# EasyEDA Pro project ProPrj_neopixel-seven-segment-display.epro

# Schematic neopixel-seven-segment-display

## Sheets
1 LEDs: Board Name: neopixel-seven-segment-display; Create Date: 2024-04-22; Page Name: LEDs; Project Name: neopixel-seven-segment-display; Schematic Name: neopixel-seven-segment-display; Update Date: 2025-08-29; Company: JES; Drawn: Justin F.; Page Size: A2; Reviewed: Justin F.; Version: V1.0
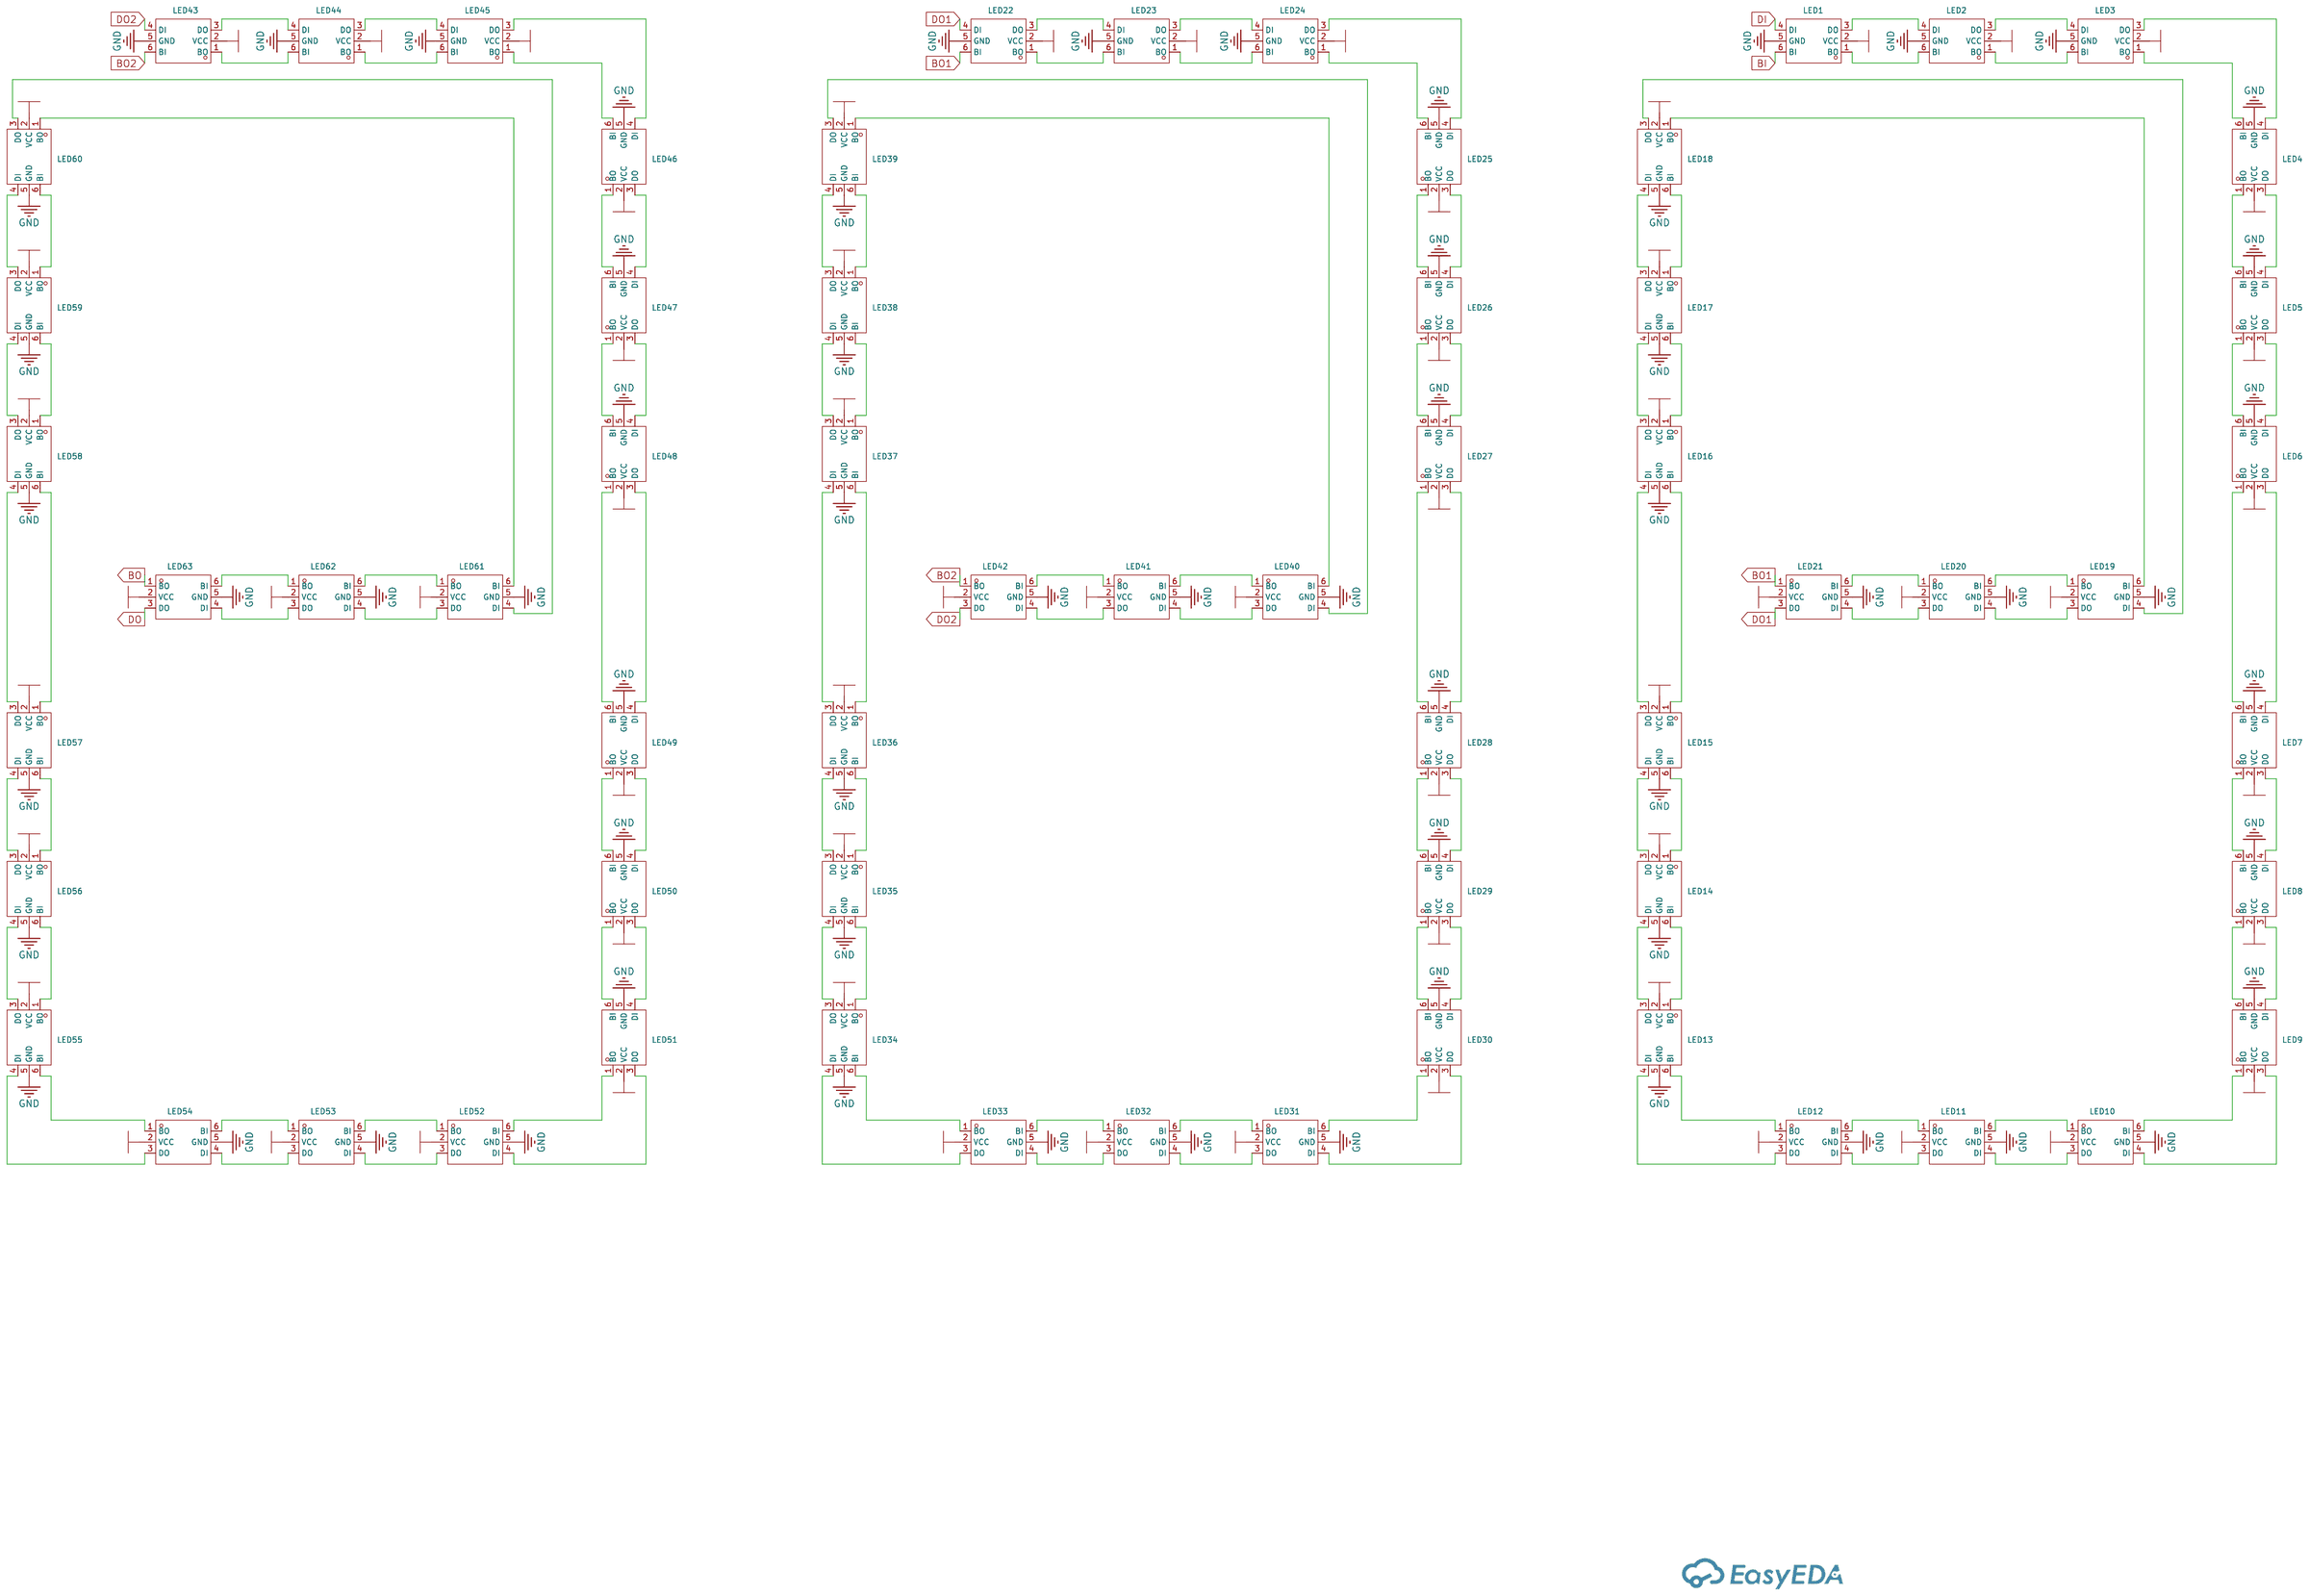
[diagram p0: LEDs]
2 Components: Page Name: Components; Update Date: 2026-04-27; Page Size: A4; Version: V2.0
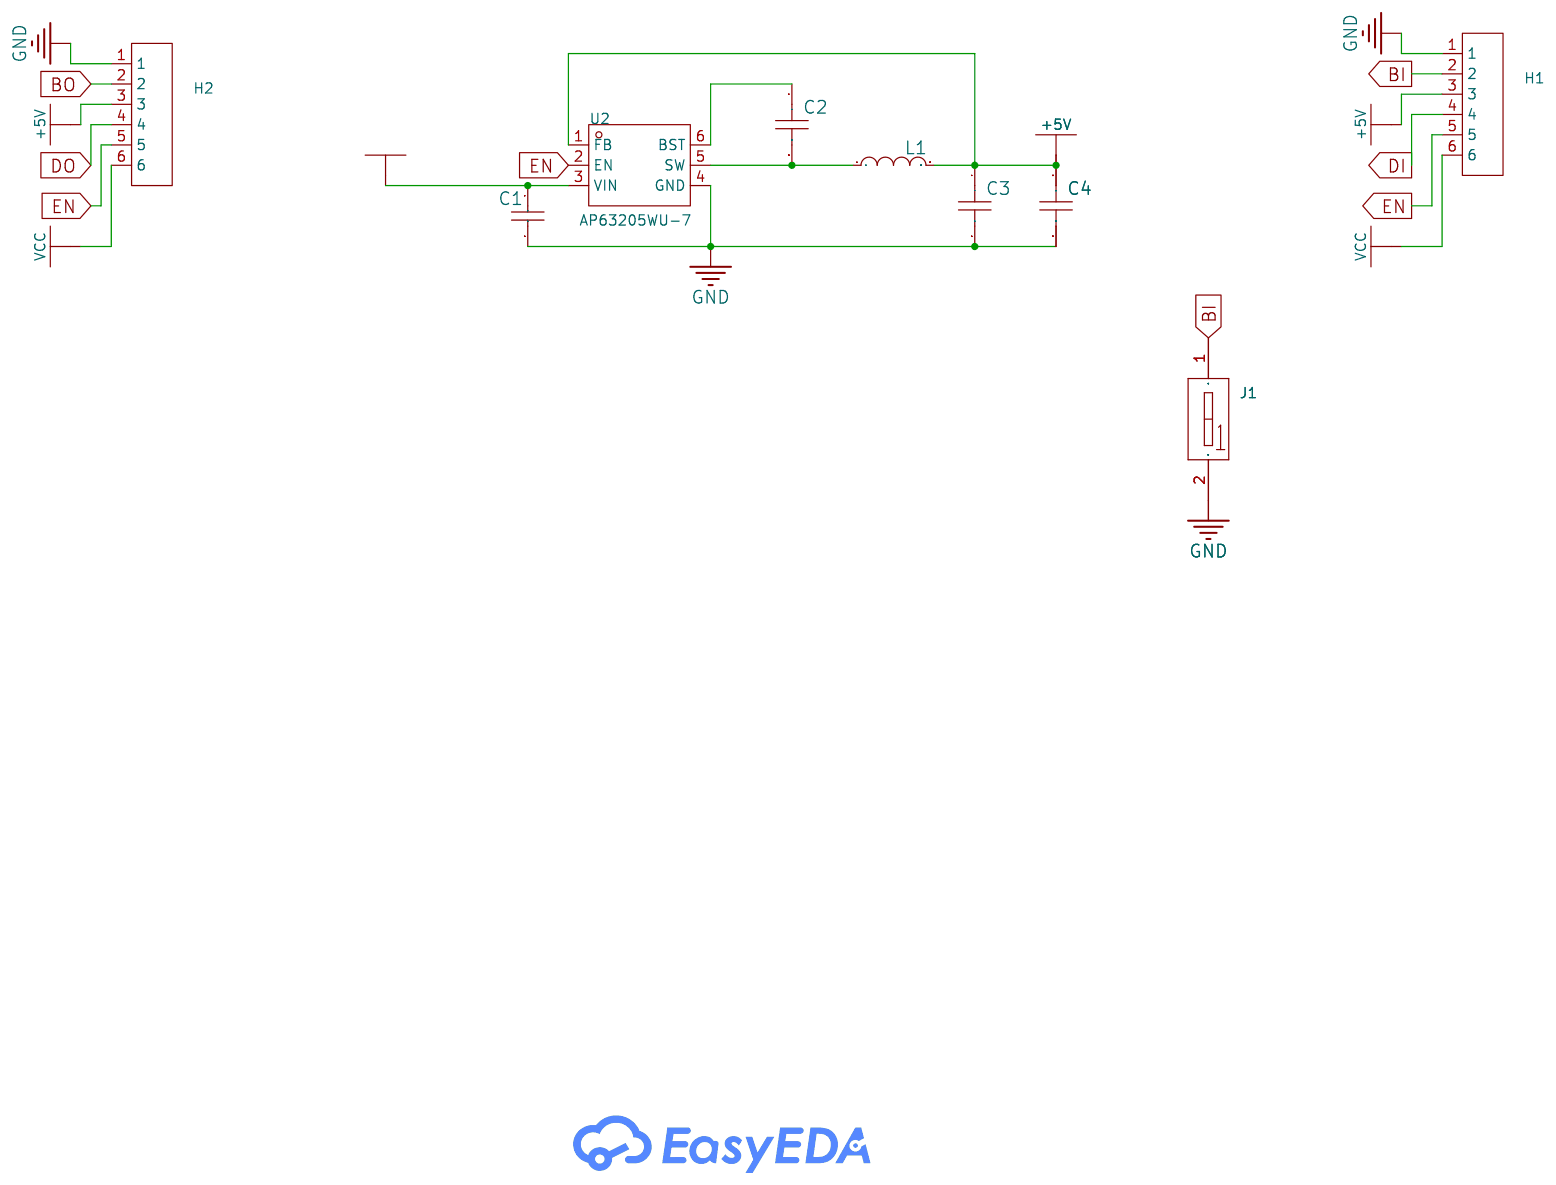
[diagram p1: Components]

## Parts
sheet Components
C1  10uF  [C1210]
C2  100nF  [C1206]
C3  22uF  [C1210]
C4  22uF  [C1210]
H1  DB2EVC-2.54-6P-GN  [CONN-TH_6P-P2.54_DIBO_DB2EVC-2.54-6P-GN]
H2  DB2EVC-2.54-6P-GN  [CONN-TH_6P-P2.54_DIBO_DB2EVC-2.54-6P-GN]
J1  DSWB01LHGET  [SW-TH_DSWB01LHGET]
L1  4.7uH  [IND-SMD_L3.2-W2.5_CMI3225XX]
U2  AP63205WU-7  [TSOT-23-6_L2.9-W1.6-P0.95-LS2.8-BL]
sheet LEDs
LED1  WS2813B-V5  [LED-SMD_6P-L5.0-W5.0-TL]
LED2  WS2813B-V5  [LED-SMD_6P-L5.0-W5.0-TL]
LED3  WS2813B-V5  [LED-SMD_6P-L5.0-W5.0-TL]
LED4  WS2813B-V5  [LED-SMD_6P-L5.0-W5.0-TL]
LED5  WS2813B-V5  [LED-SMD_6P-L5.0-W5.0-TL]
LED6  WS2813B-V5  [LED-SMD_6P-L5.0-W5.0-TL]
LED7  WS2813B-V5  [LED-SMD_6P-L5.0-W5.0-TL]
LED8  WS2813B-V5  [LED-SMD_6P-L5.0-W5.0-TL]
LED9  WS2813B-V5  [LED-SMD_6P-L5.0-W5.0-TL]
LED10  WS2813B-V5  [LED-SMD_6P-L5.0-W5.0-TL]
LED11  WS2813B-V5  [LED-SMD_6P-L5.0-W5.0-TL]
LED12  WS2813B-V5  [LED-SMD_6P-L5.0-W5.0-TL]
LED13  WS2813B-V5  [LED-SMD_6P-L5.0-W5.0-TL]
LED14  WS2813B-V5  [LED-SMD_6P-L5.0-W5.0-TL]
LED15  WS2813B-V5  [LED-SMD_6P-L5.0-W5.0-TL]
LED16  WS2813B-V5  [LED-SMD_6P-L5.0-W5.0-TL]
LED17  WS2813B-V5  [LED-SMD_6P-L5.0-W5.0-TL]
LED18  WS2813B-V5  [LED-SMD_6P-L5.0-W5.0-TL]
LED19  WS2813B-V5  [LED-SMD_6P-L5.0-W5.0-TL]
LED20  WS2813B-V5  [LED-SMD_6P-L5.0-W5.0-TL]
LED21  WS2813B-V5  [LED-SMD_6P-L5.0-W5.0-TL]
LED22  WS2813B-V5  [LED-SMD_6P-L5.0-W5.0-TL]
LED23  WS2813B-V5  [LED-SMD_6P-L5.0-W5.0-TL]
LED24  WS2813B-V5  [LED-SMD_6P-L5.0-W5.0-TL]
LED25  WS2813B-V5  [LED-SMD_6P-L5.0-W5.0-TL]
LED26  WS2813B-V5  [LED-SMD_6P-L5.0-W5.0-TL]
LED27  WS2813B-V5  [LED-SMD_6P-L5.0-W5.0-TL]
LED28  WS2813B-V5  [LED-SMD_6P-L5.0-W5.0-TL]
LED29  WS2813B-V5  [LED-SMD_6P-L5.0-W5.0-TL]
LED30  WS2813B-V5  [LED-SMD_6P-L5.0-W5.0-TL]
LED31  WS2813B-V5  [LED-SMD_6P-L5.0-W5.0-TL]
LED32  WS2813B-V5  [LED-SMD_6P-L5.0-W5.0-TL]
LED33  WS2813B-V5  [LED-SMD_6P-L5.0-W5.0-TL]
LED34  WS2813B-V5  [LED-SMD_6P-L5.0-W5.0-TL]
LED35  WS2813B-V5  [LED-SMD_6P-L5.0-W5.0-TL]
LED36  WS2813B-V5  [LED-SMD_6P-L5.0-W5.0-TL]
LED37  WS2813B-V5  [LED-SMD_6P-L5.0-W5.0-TL]
LED38  WS2813B-V5  [LED-SMD_6P-L5.0-W5.0-TL]
LED39  WS2813B-V5  [LED-SMD_6P-L5.0-W5.0-TL]
LED40  WS2813B-V5  [LED-SMD_6P-L5.0-W5.0-TL]
LED41  WS2813B-V5  [LED-SMD_6P-L5.0-W5.0-TL]
LED42  WS2813B-V5  [LED-SMD_6P-L5.0-W5.0-TL]
LED43  WS2813B-V5  [LED-SMD_6P-L5.0-W5.0-TL]
LED44  WS2813B-V5  [LED-SMD_6P-L5.0-W5.0-TL]
LED45  WS2813B-V5  [LED-SMD_6P-L5.0-W5.0-TL]
LED46  WS2813B-V5  [LED-SMD_6P-L5.0-W5.0-TL]
LED47  WS2813B-V5  [LED-SMD_6P-L5.0-W5.0-TL]
LED48  WS2813B-V5  [LED-SMD_6P-L5.0-W5.0-TL]
LED49  WS2813B-V5  [LED-SMD_6P-L5.0-W5.0-TL]
LED50  WS2813B-V5  [LED-SMD_6P-L5.0-W5.0-TL]
LED51  WS2813B-V5  [LED-SMD_6P-L5.0-W5.0-TL]
LED52  WS2813B-V5  [LED-SMD_6P-L5.0-W5.0-TL]
LED53  WS2813B-V5  [LED-SMD_6P-L5.0-W5.0-TL]
LED54  WS2813B-V5  [LED-SMD_6P-L5.0-W5.0-TL]
LED55  WS2813B-V5  [LED-SMD_6P-L5.0-W5.0-TL]
LED56  WS2813B-V5  [LED-SMD_6P-L5.0-W5.0-TL]
LED57  WS2813B-V5  [LED-SMD_6P-L5.0-W5.0-TL]
LED58  WS2813B-V5  [LED-SMD_6P-L5.0-W5.0-TL]
LED59  WS2813B-V5  [LED-SMD_6P-L5.0-W5.0-TL]
LED60  WS2813B-V5  [LED-SMD_6P-L5.0-W5.0-TL]
LED61  WS2813B-V5  [LED-SMD_6P-L5.0-W5.0-TL]
LED62  WS2813B-V5  [LED-SMD_6P-L5.0-W5.0-TL]
LED63  WS2813B-V5  [LED-SMD_6P-L5.0-W5.0-TL]

## Library data of the parts
C1 = CL32B106KAJNNNE: Capacitance: Tolerance:±10% Tolerance:±10% Voltage Rated: Temperature Coefficient:; LCSC Part Name: 10uF ±10% 25V; Supplier Part: C39232; Manufacturer: SAMSUNG(三星); Supplier Footprint: 1210; JLCPCB Part Class: Extended Part; Datasheet: https://atta.szlcsc.com/upload/public/pdf/source/20160218/1457707763339.pdf; Supplier: LCSC; Tolerance: ±10%; Check: false
C2 = 1206N104J500CT: Capacitance: Tolerance:±5% Tolerance:±5% Voltage Rated: Temperature Coefficient:; LCSC Part Name: 100nF ±5% 50V; Supplier Part: C170182; Manufacturer: Walsin(华新科); Supplier Footprint: 1206; JLCPCB Part Class: Extended Part; Datasheet: https://atta.szlcsc.com/upload/public/pdf/source/20190524/C388053_0CD3F469255EF43E616A57DAC128F58D.pdf; Supplier: LCSC; Tolerance: ±5%; Check: false
C3 C4 = CL32B226KAJNNNE: Capacitance: Tolerance:±10% Tolerance:±10% Voltage Rated: Temperature Coefficient:; LCSC Part Name: 22uF ±10% 25V; Supplier Part: C309062; Manufacturer: SAMSUNG(三星); Supplier Footprint: 1210; JLCPCB Part Class: Extended Part; Datasheet: https://atta.szlcsc.com/upload/public/pdf/source/20160218/1457707763339.pdf; Supplier: LCSC; Tolerance: ±10%; Check: false
H1 H2 = DB2EVC-2.54-6P-GN: Connector Type:Board Side/Socket - Closed Termination Style:- Number of Positions or Pins:1x6P Pitch:2.54mm Color:Green Mounting Type:Through Hole Number of Pins:6P Number of Rows:1 Number of PINs Per Row:6 Current Rating:5A Voltage Rating (Max):320V Wire; LCSC Part Name: 1x6P 2.54mm 排数:1 每排P数:6; Supplier Part: C2927497; Manufacturer: DORABO(地博电气); Supplier Footprint: 插件,P=2.54mm; JLCPCB Part Class: Extended Part; Datasheet: https://item.szlcsc.com/datasheet/DB2EVC-2.54-6P-GN/3255033.html; Supplier: LCSC; Connector Type: Board Side/Socket - Closed; Number of Positions or Pins: 1x6P; Pitch: 2.54mm; Color: Green; Mounting Type: Through Hole; Number of Pins: 6P; Number of Rows: 1; Number of PINs Per Row: 6; Current Rating: 5A; Voltage Rating (Max): 320V; Operating Temperature: -40℃~+105℃
J1 = DSWB01LHGET: Type:Slide, Rocked Circuit:SPST Number of Positions:1 Lead Pitch:- Operating Life:- Color:Red; LCSC Part Name: 红色宽体1位顶拨插件; Supplier Part: C126888; Manufacturer: YE; Supplier Footprint: 插件,9.9x4mm; JLCPCB Part Class: Extended Part; Datasheet: https://item.szlcsc.com/datasheet/DSWB01LHGET/138168.html; Supplier: LCSC; Type: Slide, Rocked; Circuit: SPST; Number of Positions: 1; Color: Red
L1 = DFE322520FD-4R7M=P2: Inductance: Tolerance:±20% Tolerance:±20% Rated Current:2A Saturation Current (Isat):3.4A DC Resistance (DCR): Ratings:AEC-Q200; LCSC Part Name: 4.7uH ±20% 3.4A; Supplier Part: C2045343; Manufacturer: muRata(村田); Supplier Footprint: 1210; JLCPCB Part Class: Extended Part; Datasheet: https://atta.szlcsc.com/upload/public/pdf/source/20230811/E685BADDC9D496FFC5350CE0F3D93440.pdf; Supplier: LCSC; Tolerance: ±20%; Rated Current: 2A; Saturation Current (Isat): 3.4A; DC Resistance (DCR): 34.5mΩ; Ratings: AEC-Q200; Check: false
U2 = AP63205WU-7: Function:Buck Voltage - Supply:3.8V~32V Voltage - Supply:3.8V~32V Output Voltage:5V Output Voltage:5V Output Current:2A Frequency - Switching:1.1MHz Frequency - Switching:1.1MHz Operating Temperature:-40℃~+85℃@(TA) Operating Temperature:-40℃~+85℃@(TA) Syn; LCSC Part Name: 3.8V至32V输入、2A低静态电流同步降压转换器，增强EMI抑制; Supplier Part: C2071056; Manufacturer: DIODES(美台); Supplier Footprint: TSOT-23-6; JLCPCB Part Class: Extended Part; Datasheet: https://item.szlcsc.com/datasheet/AP63205WU-7/2162639.html; Supplier: LCSC; Function: Buck; Synchronous Rectification: Yes; Output Type: Fixed; Number of Outputs: 1; Topology: Buck; Input Voltage: 3.8V~32V; Output Voltage: 5V; Output Current (Max): 2A; Switching Frequency: 1.1MHz; Operating Temperature: -40℃~+85℃@(TA); Check: false; Voltage - Supply: 3.8V~32V; Output Current: 2A; Frequency - Switching: 1.1MHz; Synchronous Rectifier: Yes; Quiescent Current: 22uA; Switch tube (built-in/external): Built-In
LED1-LED63 = WS2813B-V5: Emitted Color:RGB Power Dissipation:- Forward Current:16mA Dominant Wavelength:623nm；471nm；520nm Dominant Wavelength:623nm；471nm；520nm Peak Wavelength:- Diode Configuration:- Lens Color:- Color Temperature:- Color Temperature:- Viewing Angle:- Mounting Sy; LCSC Part Name: RGB三色; Supplier Part: C965558; Manufacturer: worldsemi; Supplier Footprint: SMD5050; JLCPCB Part Class: Extended Part; Datasheet: https://atta.szlcsc.com/upload/public/pdf/source/20201203/C965558_3788C892C3E72C9CF7EE66566AC16D5A.pdf; Supplier: LCSC; Emitted Color: RGB; Forward Current: 16mA; Dominant Wavelength: 623nm；471nm；520nm; Check: false

## Nets
+5V: C3.1 C4.1 H1.3 H2.3 L1.2 LED1.2(VCC) LED2.2(VCC) LED3.2(VCC) LED4.2(VCC) LED5.2(VCC) LED6.2(VCC) LED7.2(VCC) LED8.2(VCC) LED9.2(VCC) LED10.2(VCC) LED11.2(VCC) LED12.2(VCC) LED13.2(VCC) LED14.2(VCC) LED15.2(VCC) LED16.2(VCC) LED17.2(VCC) LED18.2(VCC) LED19.2(VCC) LED20.2(VCC) LED21.2(VCC) LED22.2(VCC) LED23.2(VCC) LED24.2(VCC) LED25.2(VCC) LED26.2(VCC) LED27.2(VCC) LED28.2(VCC) LED29.2(VCC) LED30.2(VCC) LED31.2(VCC) LED32.2(VCC) LED33.2(VCC) LED34.2(VCC) LED35.2(VCC) LED36.2(VCC) LED37.2(VCC) LED38.2(VCC) LED39.2(VCC) LED40.2(VCC) LED41.2(VCC) LED42.2(VCC) LED43.2(VCC) LED44.2(VCC) LED45.2(VCC) LED46.2(VCC) LED47.2(VCC) LED48.2(VCC) LED49.2(VCC) LED50.2(VCC) LED51.2(VCC) LED52.2(VCC) LED53.2(VCC) LED54.2(VCC) LED55.2(VCC) LED56.2(VCC) LED57.2(VCC) LED58.2(VCC) LED59.2(VCC) LED60.2(VCC) LED61.2(VCC) LED62.2(VCC) LED63.2(VCC) U2.1(FB)
GND: C1.2 C3.2 C4.2 H1.1 H2.1 J1.2 LED1.5(GND) LED2.5(GND) LED3.5(GND) LED4.5(GND) LED5.5(GND) LED6.5(GND) LED7.5(GND) LED8.5(GND) LED9.5(GND) LED10.5(GND) LED11.5(GND) LED12.5(GND) LED13.5(GND) LED14.5(GND) LED15.5(GND) LED16.5(GND) LED17.5(GND) LED18.5(GND) LED19.5(GND) LED20.5(GND) LED21.5(GND) LED22.5(GND) LED23.5(GND) LED24.5(GND) LED25.5(GND) LED26.5(GND) LED27.5(GND) LED28.5(GND) LED29.5(GND) LED30.5(GND) LED31.5(GND) LED32.5(GND) LED33.5(GND) LED34.5(GND) LED35.5(GND) LED36.5(GND) LED37.5(GND) LED38.5(GND) LED39.5(GND) LED40.5(GND) LED41.5(GND) LED42.5(GND) LED43.5(GND) LED44.5(GND) LED45.5(GND) LED46.5(GND) LED47.5(GND) LED48.5(GND) LED49.5(GND) LED50.5(GND) LED51.5(GND) LED52.5(GND) LED53.5(GND) LED54.5(GND) LED55.5(GND) LED56.5(GND) LED57.5(GND) LED58.5(GND) LED59.5(GND) LED60.5(GND) LED61.5(GND) LED62.5(GND) LED63.5(GND) U2.4(GND)
VCC: C1.1 H1.6 H2.6 U2.3(VIN)
BI: H1.2 J1.1(A1) LED1.6(BI)
BO: H2.2 LED63.1(BO)
BO1: LED21.1(BO) LED22.6(BI)
BO2: LED42.1(BO) LED43.6(BI)
DI: H1.4 LED1.4(DI)
DO: H2.4 LED63.3(DO)
DO1: LED21.3(DO) LED22.4(DI)
DO2: LED42.3(DO) LED43.4(DI)
EN: H1.5 H2.5 U2.2(EN)
$2N332268: LED1.3(DO) LED2.4(DI)
$2N332275: LED2.3(DO) LED3.4(DI)
$2N332294: LED1.1(BO) LED2.6(BI)
$2N332300: LED2.1(BO) LED3.6(BI)
$2N332306: LED3.1(BO) LED4.6(BI)
$2N332313: LED3.3(DO) LED4.4(DI)
$2N332321: LED4.1(BO) LED5.6(BI)
$2N332324: LED4.3(DO) LED5.4(DI)
$2N332327: LED5.1(BO) LED6.6(BI)
$2N332330: LED5.3(DO) LED6.4(DI)
$2N332493: LED7.1(BO) LED8.6(BI)
$2N332495: LED7.3(DO) LED8.4(DI)
$2N332497: LED8.1(BO) LED9.6(BI)
$2N332499: LED8.3(DO) LED9.4(DI)
$2N332503: LED9.1(BO) LED10.6(BI)
$2N332507: LED9.3(DO) LED10.4(DI)
$2N332511: LED10.3(DO) LED11.4(DI)
$2N332514: LED10.1(BO) LED11.6(BI)
$2N332517: LED11.1(BO) LED12.6(BI)
$2N332520: LED11.3(DO) LED12.4(DI)
$2N332523: LED12.3(DO) LED13.4(DI)
$2N332527: LED12.1(BO) LED13.6(BI)
$2N332531: LED13.3(DO) LED14.4(DI)
$2N332534: LED13.1(BO) LED14.6(BI)
$2N332537: LED14.3(DO) LED15.4(DI)
$2N332543: LED14.1(BO) LED15.6(BI)
$2N332549: LED15.3(DO) LED16.4(DI)
$2N332556: LED15.1(BO) LED16.6(BI)
$2N332563: LED16.3(DO) LED17.4(DI)
$2N332570: LED16.1(BO) LED17.6(BI)
$2N332577: LED17.3(DO) LED18.4(DI)
$2N332584: LED17.1(BO) LED18.6(BI)
$2N332696: LED6.1(BO) LED7.6(BI)
$2N332699: LED6.3(DO) LED7.4(DI)
$2N332702: LED18.1(BO) LED19.6(BI)
$2N332706: LED18.3(DO) LED19.4(DI)
$2N332712: LED19.1(BO) LED20.6(BI)
$2N332718: LED19.3(DO) LED20.4(DI)
$2N332724: LED20.1(BO) LED21.6(BI)
$2N332731: LED20.3(DO) LED21.4(DI)
$2N335047: LED22.3(DO) LED23.4(DI)
$2N335051: LED23.3(DO) LED24.4(DI)
$2N335055: LED22.1(BO) LED23.6(BI)
$2N335060: LED23.1(BO) LED24.6(BI)
$2N335064: LED24.1(BO) LED25.6(BI)
$2N335069: LED24.3(DO) LED25.4(DI)
$2N335074: LED25.1(BO) LED26.6(BI)
$2N335078: LED25.3(DO) LED26.4(DI)
$2N335082: LED26.1(BO) LED27.6(BI)
$2N335086: LED26.3(DO) LED27.4(DI)
$2N335090: LED28.1(BO) LED29.6(BI)
$2N335094: LED28.3(DO) LED29.4(DI)
$2N335098: LED29.1(BO) LED30.6(BI)
$2N335102: LED29.3(DO) LED30.4(DI)
$2N335106: LED30.1(BO) LED31.6(BI)
$2N335111: LED30.3(DO) LED31.4(DI)
$2N335116: LED31.3(DO) LED32.4(DI)
$2N335120: LED31.1(BO) LED32.6(BI)
$2N335124: LED32.1(BO) LED33.6(BI)
$2N335128: LED32.3(DO) LED33.4(DI)
$2N335132: LED33.3(DO) LED34.4(DI)
$2N335137: LED33.1(BO) LED34.6(BI)
$2N335142: LED34.3(DO) LED35.4(DI)
$2N335146: LED34.1(BO) LED35.6(BI)
$2N335150: LED35.3(DO) LED36.4(DI)
$2N335154: LED35.1(BO) LED36.6(BI)
$2N335158: LED36.3(DO) LED37.4(DI)
$2N335162: LED36.1(BO) LED37.6(BI)
$2N335166: LED37.3(DO) LED38.4(DI)
$2N335170: LED37.1(BO) LED38.6(BI)
$2N335174: LED38.3(DO) LED39.4(DI)
$2N335178: LED38.1(BO) LED39.6(BI)
$2N335182: LED27.1(BO) LED28.6(BI)
$2N335186: LED27.3(DO) LED28.4(DI)
$2N335190: LED39.1(BO) LED40.6(BI)
$2N335193: LED39.3(DO) LED40.4(DI)
$2N335200: LED40.1(BO) LED41.6(BI)
$2N335204: LED40.3(DO) LED41.4(DI)
$2N335208: LED41.1(BO) LED42.6(BI)
$2N335212: LED41.3(DO) LED42.4(DI)
$2N338899: LED43.3(DO) LED44.4(DI)
$2N338903: LED44.3(DO) LED45.4(DI)
$2N338907: LED43.1(BO) LED44.6(BI)
$2N338911: LED44.1(BO) LED45.6(BI)
$2N338915: LED45.1(BO) LED46.6(BI)
$2N338920: LED45.3(DO) LED46.4(DI)
$2N338925: LED46.1(BO) LED47.6(BI)
$2N338929: LED46.3(DO) LED47.4(DI)
$2N338933: LED47.1(BO) LED48.6(BI)
$2N338937: LED47.3(DO) LED48.4(DI)
$2N338941: LED49.1(BO) LED50.6(BI)
$2N338945: LED49.3(DO) LED50.4(DI)
$2N338949: LED50.1(BO) LED51.6(BI)
$2N338953: LED50.3(DO) LED51.4(DI)
$2N338957: LED51.1(BO) LED52.6(BI)
$2N338962: LED51.3(DO) LED52.4(DI)
$2N338967: LED52.3(DO) LED53.4(DI)
$2N338971: LED52.1(BO) LED53.6(BI)
$2N338975: LED53.1(BO) LED54.6(BI)
$2N338979: LED53.3(DO) LED54.4(DI)
$2N338983: LED54.3(DO) LED55.4(DI)
$2N338988: LED54.1(BO) LED55.6(BI)
$2N338993: LED55.3(DO) LED56.4(DI)
$2N338997: LED55.1(BO) LED56.6(BI)
$2N339001: LED56.3(DO) LED57.4(DI)
$2N339005: LED56.1(BO) LED57.6(BI)
$2N339009: LED57.3(DO) LED58.4(DI)
$2N339013: LED57.1(BO) LED58.6(BI)
$2N339017: LED58.3(DO) LED59.4(DI)
$2N339021: LED58.1(BO) LED59.6(BI)
$2N339025: LED59.3(DO) LED60.4(DI)
$2N339029: LED59.1(BO) LED60.6(BI)
$2N339033: LED48.1(BO) LED49.6(BI)
$2N339037: LED48.3(DO) LED49.4(DI)
$2N339041: LED60.1(BO) LED61.6(BI)
$2N339044: LED60.3(DO) LED61.4(DI)
$2N339051: LED61.1(BO) LED62.6(BI)
$2N339055: LED61.3(DO) LED62.4(DI)
$2N339059: LED62.1(BO) LED63.6(BI)
$2N339063: LED62.3(DO) LED63.4(DI)
$3N5692: C2.2 L1.1 U2.5(SW)
$3N12733: C2.1 U2.6(BST)

# Board neopixel-seven-segment-display
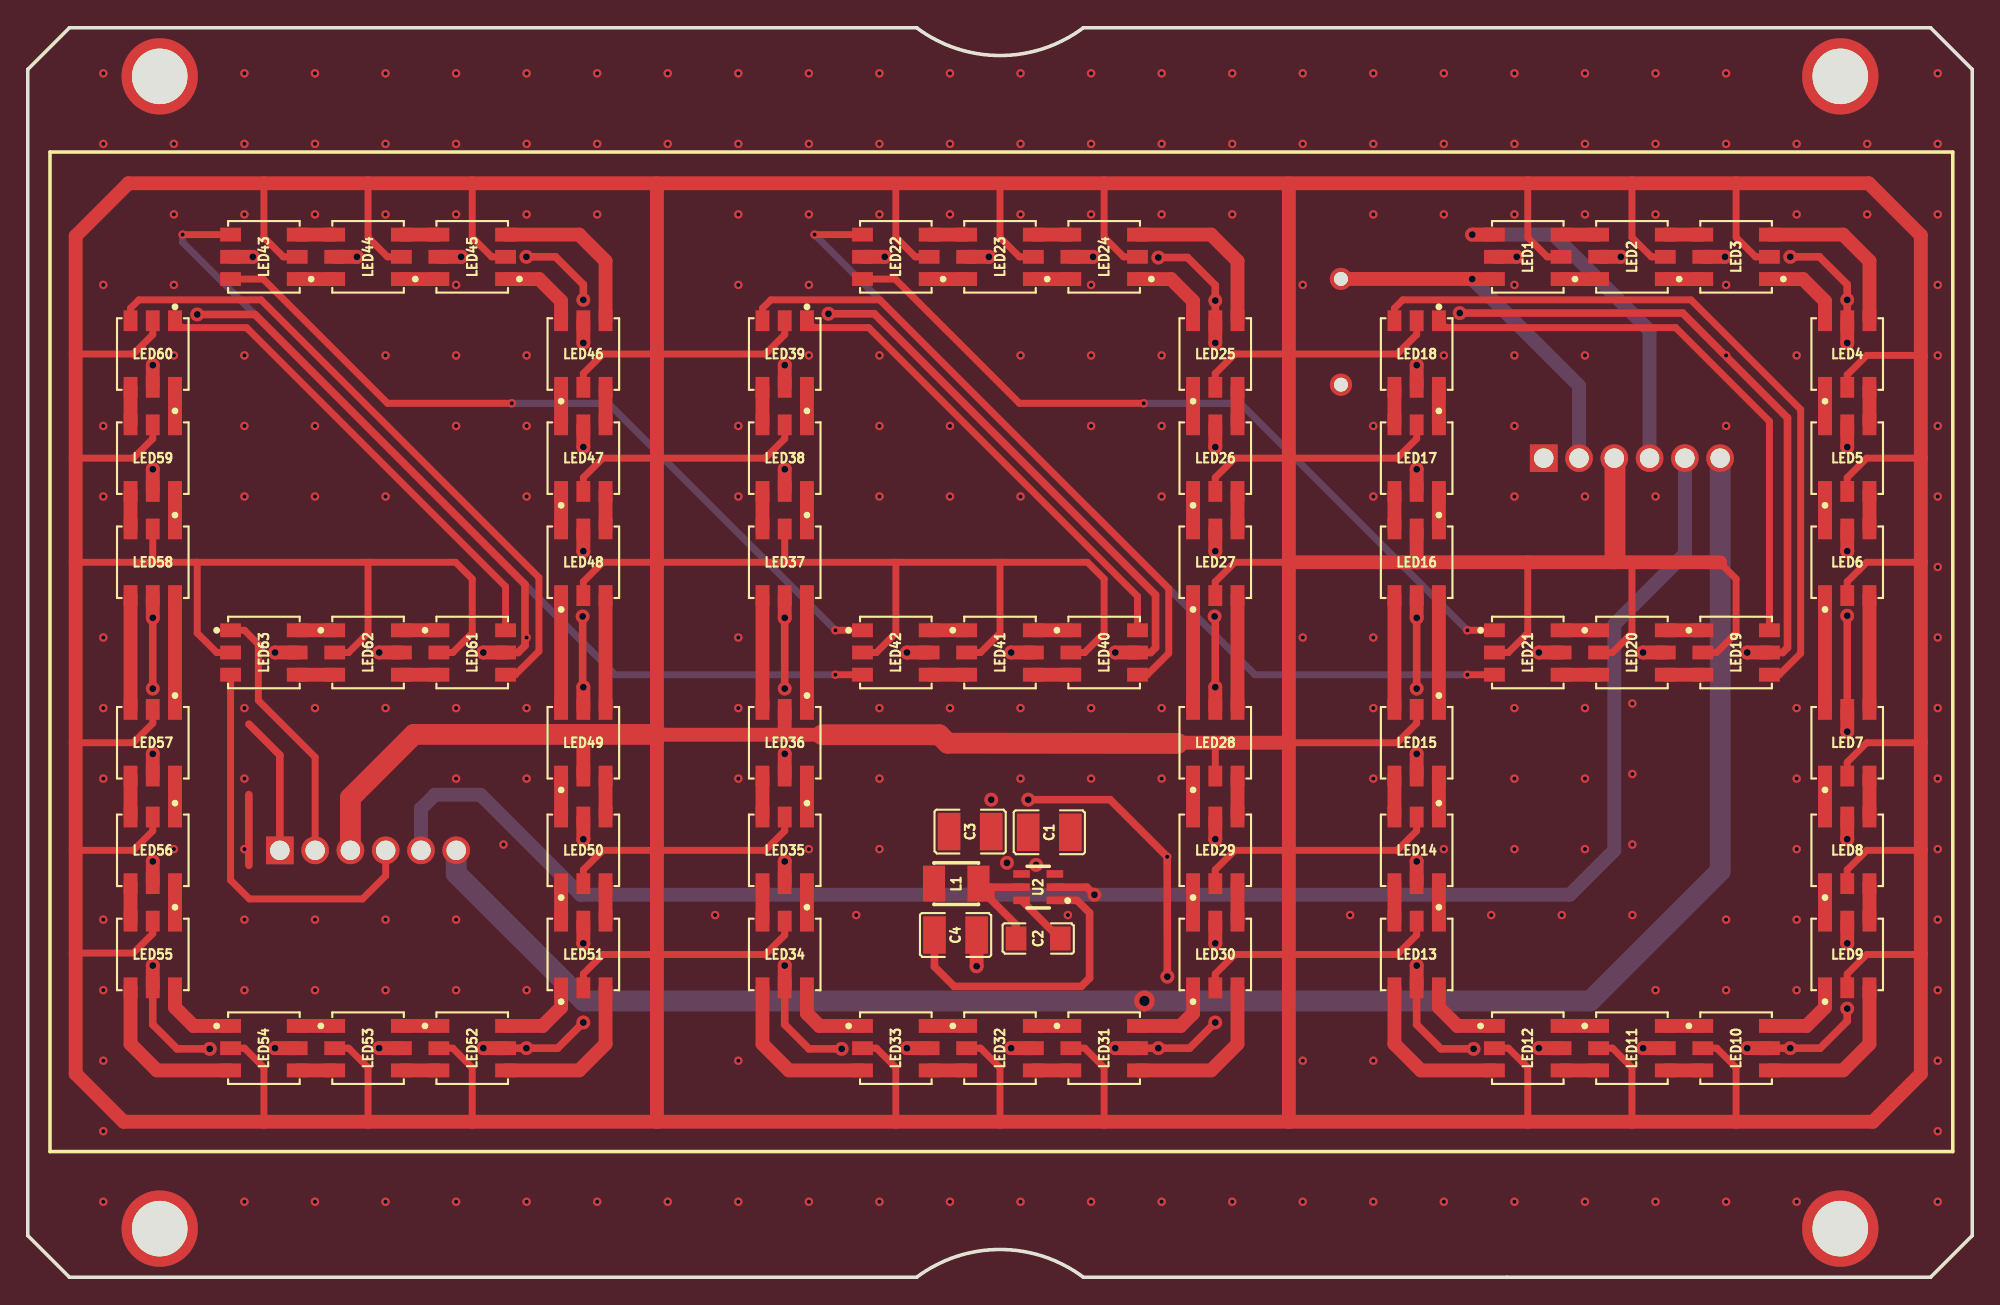
[diagram p2: board, top side]
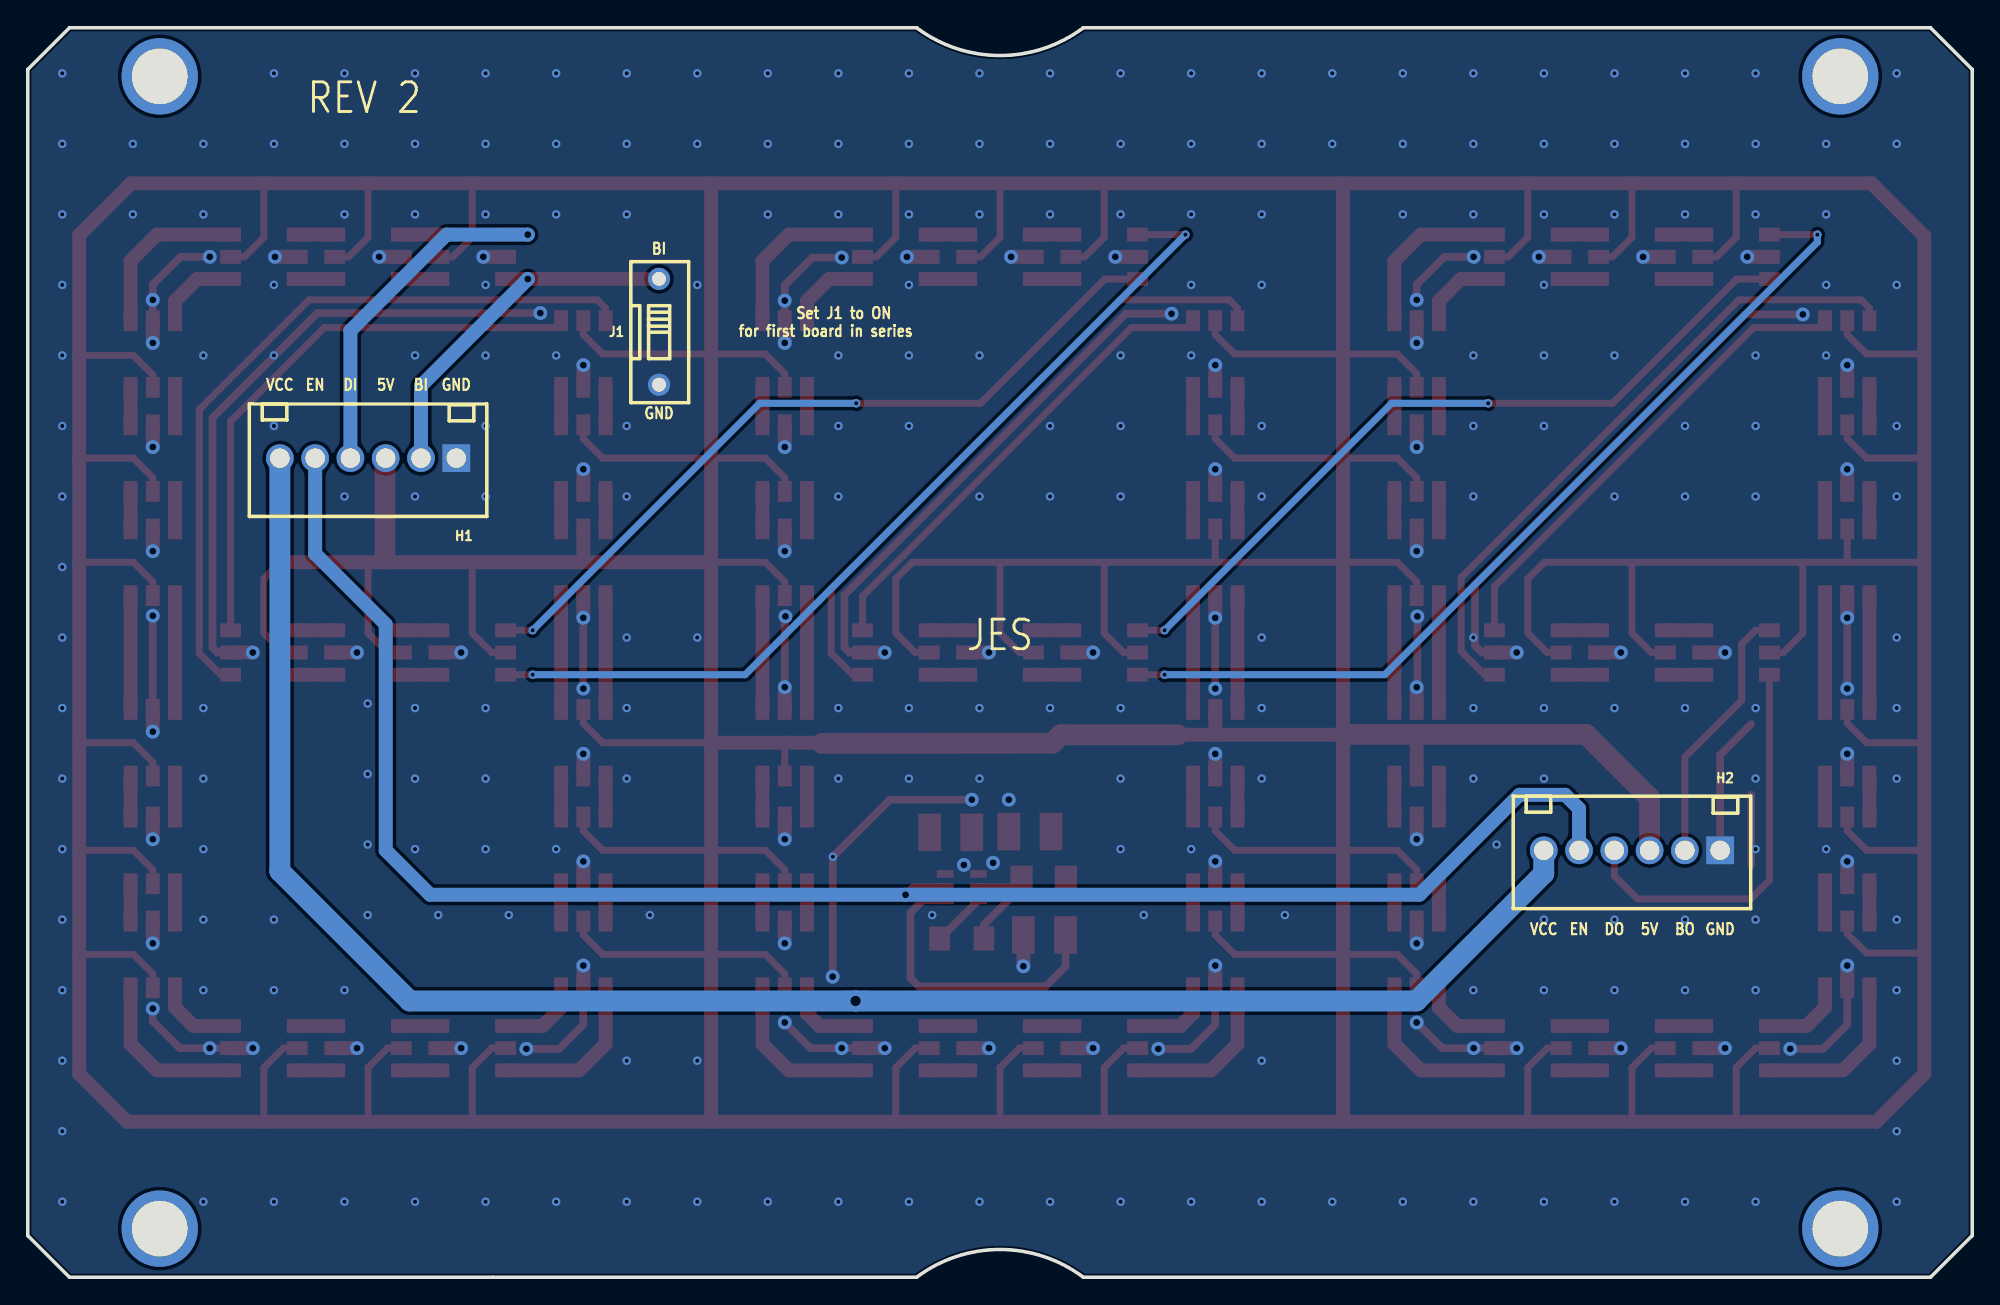
[diagram p3: board, bottom side, seen from below]

Outline 140 x 90 mm; copper layers: Top Layer, Bottom Layer. Coordinates in mm from the lower left corner of the outline.
Outline path: 0,87 3,90 64,90 arc(70,88) 76,90 137,90 140,87 140,3 137,0 76,0 arc(70,2) 64,0 3,0 0,3 0,87
Stack: Top Layer 0.035mm - / Dielectric1 1.51mm FR4 er 4.5 / Bottom Layer 0.035mm -

## Design rules (mm)
template: User Custom Config
spacing Default (default): track to track 0.152, other pairs 0 to 0.152
track width Default (default): min 0.2, default 0.254, max 25.4
track width VDD Bus: min 0.55, default 0.6, max 2.54
differential pair differentialPair (default): width min 0.127, default 0.254, max 2.54; gap min 0.152, default 0.152
via Default (default): diameter min 0.61, default 0.61, max 100.025; hole min 0.305, default 0.305, max 59.995
net GND uses direct
net +5V uses direct
net VCC uses direct

## Placement (name value [footprint] x y rotation side)
C1  10uF  [C1210]  73.55 32.05 180 top
C2  100nF  [C1206]  72.75 24.4 180 top
C3  22uF  [C1210]  67.85 32.1 0 top
C4  22uF  [C1210]  66.8 24.65 0 top
H1  DB2EVC-2.54-6P-GN  [CONN-TH_6P-P2.54_DIBO_DB2EVC-2.54-6P-GN]  115.5 59 0 bottom
H2  DB2EVC-2.54-6P-GN  [CONN-TH_6P-P2.54_DIBO_DB2EVC-2.54-6P-GN]  24.5 30.75 0 bottom
J1  DSWB01LHGET  [SW-TH_DSWB01LHGET]  94.55 68.1 180 bottom
L1  4.7uH  [IND-SMD_L3.2-W2.5_CMI3225XX]  66.85 28.35 180 top
LED1  WS2813B-V5  [LED-SMD_6P-L5.0-W5.0-TL]  108 73.5 180 top
LED2  WS2813B-V5  [LED-SMD_6P-L5.0-W5.0-TL]  115.5 73.5 180 top
LED3  WS2813B-V5  [LED-SMD_6P-L5.0-W5.0-TL]  123 73.5 180 top
LED4  WS2813B-V5  [LED-SMD_6P-L5.0-W5.0-TL]  131 66.5 90 top
LED5  WS2813B-V5  [LED-SMD_6P-L5.0-W5.0-TL]  131 59 90 top
LED6  WS2813B-V5  [LED-SMD_6P-L5.0-W5.0-TL]  131 51.5 90 top
LED7  WS2813B-V5  [LED-SMD_6P-L5.0-W5.0-TL]  131 38.5 90 top
LED8  WS2813B-V5  [LED-SMD_6P-L5.0-W5.0-TL]  131 30.75 90 top
LED9  WS2813B-V5  [LED-SMD_6P-L5.0-W5.0-TL]  131 23.25 90 top
LED10  WS2813B-V5  [LED-SMD_6P-L5.0-W5.0-TL]  123 16.5 0 top
LED11  WS2813B-V5  [LED-SMD_6P-L5.0-W5.0-TL]  115.5 16.5 0 top
LED12  WS2813B-V5  [LED-SMD_6P-L5.0-W5.0-TL]  108 16.5 0 top
LED13  WS2813B-V5  [LED-SMD_6P-L5.0-W5.0-TL]  100 23.25 270 top
LED14  WS2813B-V5  [LED-SMD_6P-L5.0-W5.0-TL]  100 30.75 270 top
LED15  WS2813B-V5  [LED-SMD_6P-L5.0-W5.0-TL]  100 38.5 270 top
LED16  WS2813B-V5  [LED-SMD_6P-L5.0-W5.0-TL]  100 51.5 270 top
LED17  WS2813B-V5  [LED-SMD_6P-L5.0-W5.0-TL]  100 59 270 top
LED18  WS2813B-V5  [LED-SMD_6P-L5.0-W5.0-TL]  100 66.5 270 top
LED19  WS2813B-V5  [LED-SMD_6P-L5.0-W5.0-TL]  123 45 0 top
LED20  WS2813B-V5  [LED-SMD_6P-L5.0-W5.0-TL]  115.5 45 0 top
LED21  WS2813B-V5  [LED-SMD_6P-L5.0-W5.0-TL]  108 45 0 top
LED22  WS2813B-V5  [LED-SMD_6P-L5.0-W5.0-TL]  62.5 73.5 180 top
LED23  WS2813B-V5  [LED-SMD_6P-L5.0-W5.0-TL]  70 73.5 180 top
LED24  WS2813B-V5  [LED-SMD_6P-L5.0-W5.0-TL]  77.5 73.5 180 top
LED25  WS2813B-V5  [LED-SMD_6P-L5.0-W5.0-TL]  85.5 66.5 90 top
LED26  WS2813B-V5  [LED-SMD_6P-L5.0-W5.0-TL]  85.5 59 90 top
LED27  WS2813B-V5  [LED-SMD_6P-L5.0-W5.0-TL]  85.5 51.5 90 top
LED28  WS2813B-V5  [LED-SMD_6P-L5.0-W5.0-TL]  85.5 38.5 90 top
LED29  WS2813B-V5  [LED-SMD_6P-L5.0-W5.0-TL]  85.5 30.75 90 top
LED30  WS2813B-V5  [LED-SMD_6P-L5.0-W5.0-TL]  85.5 23.25 90 top
LED31  WS2813B-V5  [LED-SMD_6P-L5.0-W5.0-TL]  77.5 16.5 0 top
LED32  WS2813B-V5  [LED-SMD_6P-L5.0-W5.0-TL]  70 16.5 0 top
LED33  WS2813B-V5  [LED-SMD_6P-L5.0-W5.0-TL]  62.5 16.5 0 top
LED34  WS2813B-V5  [LED-SMD_6P-L5.0-W5.0-TL]  54.5 23.25 270 top
LED35  WS2813B-V5  [LED-SMD_6P-L5.0-W5.0-TL]  54.5 30.75 270 top
LED36  WS2813B-V5  [LED-SMD_6P-L5.0-W5.0-TL]  54.5 38.5 270 top
LED37  WS2813B-V5  [LED-SMD_6P-L5.0-W5.0-TL]  54.5 51.5 270 top
LED38  WS2813B-V5  [LED-SMD_6P-L5.0-W5.0-TL]  54.5 59 270 top
LED39  WS2813B-V5  [LED-SMD_6P-L5.0-W5.0-TL]  54.5 66.5 270 top
LED40  WS2813B-V5  [LED-SMD_6P-L5.0-W5.0-TL]  77.5 45 0 top
LED41  WS2813B-V5  [LED-SMD_6P-L5.0-W5.0-TL]  70 45 0 top
LED42  WS2813B-V5  [LED-SMD_6P-L5.0-W5.0-TL]  62.5 45 0 top
LED43  WS2813B-V5  [LED-SMD_6P-L5.0-W5.0-TL]  17 73.5 180 top
LED44  WS2813B-V5  [LED-SMD_6P-L5.0-W5.0-TL]  24.5 73.5 180 top
LED45  WS2813B-V5  [LED-SMD_6P-L5.0-W5.0-TL]  32 73.5 180 top
LED46  WS2813B-V5  [LED-SMD_6P-L5.0-W5.0-TL]  40 66.5 90 top
LED47  WS2813B-V5  [LED-SMD_6P-L5.0-W5.0-TL]  40 59 90 top
LED48  WS2813B-V5  [LED-SMD_6P-L5.0-W5.0-TL]  40 51.5 90 top
LED49  WS2813B-V5  [LED-SMD_6P-L5.0-W5.0-TL]  40 38.5 90 top
LED50  WS2813B-V5  [LED-SMD_6P-L5.0-W5.0-TL]  40 30.75 90 top
LED51  WS2813B-V5  [LED-SMD_6P-L5.0-W5.0-TL]  40 23.25 90 top
LED52  WS2813B-V5  [LED-SMD_6P-L5.0-W5.0-TL]  32 16.5 0 top
LED53  WS2813B-V5  [LED-SMD_6P-L5.0-W5.0-TL]  24.5 16.5 0 top
LED54  WS2813B-V5  [LED-SMD_6P-L5.0-W5.0-TL]  17 16.5 0 top
LED55  WS2813B-V5  [LED-SMD_6P-L5.0-W5.0-TL]  9 23.25 270 top
LED56  WS2813B-V5  [LED-SMD_6P-L5.0-W5.0-TL]  9 30.75 270 top
LED57  WS2813B-V5  [LED-SMD_6P-L5.0-W5.0-TL]  9 38.5 270 top
LED58  WS2813B-V5  [LED-SMD_6P-L5.0-W5.0-TL]  9 51.5 270 top
LED59  WS2813B-V5  [LED-SMD_6P-L5.0-W5.0-TL]  9 59 270 top
LED60  WS2813B-V5  [LED-SMD_6P-L5.0-W5.0-TL]  9 66.5 270 top
LED61  WS2813B-V5  [LED-SMD_6P-L5.0-W5.0-TL]  32 45 0 top
LED62  WS2813B-V5  [LED-SMD_6P-L5.0-W5.0-TL]  24.5 45 0 top
LED63  WS2813B-V5  [LED-SMD_6P-L5.0-W5.0-TL]  17 45 0 top
NOREF  -  [Pad_e19]  130.5 3.5 0 top
NOREF#2  -  [Pad_e17]  9.5 3.5 0 top
NOREF#3  -  [Pad_e18]  130.5 86.5 0 top
NOREF#4  -  [Pad_e14]  9.5 86.5 0 top
U2  AP63205WU-7  [TSOT-23-6_L2.9-W1.6-P0.95-LS2.8-BL]  72.75 28.1 90 top

## Footprints (pads in the part's own frame, mm; a bottom-side part is the same pattern mirrored in y, then rotated)
C1206
  rect 1.485x1.728 smd: 1(-1.593,0) 2(1.593,0)
C1210
  rect 1.635x2.7 smd: 1(-1.518,0) 2(1.518,0)
CONN-TH_6P-P2.54_DIBO_DB2EVC-2.54-6P-GN
  rect 2x2 hole 1.4: 1(-6.35,0)
  round 2 hole 1.4: 2(-3.81,0) 3(-1.27,0) 4(1.27,0) 5(3.81,0) 6(6.35,0)
IND-SMD_L3.2-W2.5_CMI3225XX
  rect 1.6x2.6 smd: 1(-1.6,0) 2(1.6,0)
LED-SMD_6P-L5.0-W5.0-TL
  rect 1.5x1 smd: 1(-2.4,1.6) 2(-2.4,0) 3(-2.4,-1.6) 4(2.4,-1.6) 5(2.4,0) 6(2.4,1.6)
Pad_e14
  round 5.5 hole 4: 1(0,0)
Pad_e17
  round 5.5 hole 4: 3(0,0)
Pad_e18
  round 5.5 hole 4: 2(0,0)
Pad_e19
  round 5.5 hole 4: 4(0,0)
SW-TH_DSWB01LHGET
  round 1.6 hole 1: 1(0,3.81) 2(0,-3.81)
TSOT-23-6_L2.9-W1.6-P0.95-LS2.8-BL
  rect 0.55x1.2 smd: 1(-0.95,-1.2) 2(0,-1.2) 3(0.95,-1.2) 4(0.95,1.2) 5(0,1.2) 6(-0.95,1.2)

## Nets
As in the schematic.

Pads without a net: NOREF 4; NOREF#2 3; NOREF#3 2; NOREF#4 1

## Via types
v1: diameter 1, hole 0.5, Top Layer to Bottom Layer, 96 vias
v2: diameter 0.61, hole 0.305, Top Layer to Bottom Layer, 246 vias
v3: diameter 1.5, hole 0.75, Top Layer to Bottom Layer, 1 via

## Routing (per net, layer and track width the routed paths; a pad name or vN(x,y) marks a point on that pad's centre or on a via; arc(x,y) is an arc through that point)
+5V: length 1174.4
  Top Layer w0.5: 54.5,51.5 62.5,51.5 ; 54.5,51.5 41.4,51.5 40,50.1 LED48.2 ; 54.5,51.5 LED37.2 ; 62.5,51.5 70,51.5 ; 62.5,51.5 62.5,46.4 61.1,45 LED42.2 ; LED23.2 71.4,73.5 70,74.9 70,78.8 ; 24.5,78.8 24.5,74.9 25.9,73.5 LED44.2 ; 17,78.8 17,74.9 18.4,73.5 LED43.2 ; 3.45,38.5 7.6,38.5 9,39.9 LED57.2 ; 9,51.5 3.45,51.5 ; 9,51.5 12.2,51.5 ; 9,51.5 LED58.2 ; 32,11.2 32,15.1 30.6,16.5 LED52.2 ; LED13.2 100,24.65 98.6,23.25 86.9,23.25 85.5,21.85 LED30.2 ; 62.5,11.2 62.5,15.1 61.1,16.5 LED33.2 ; 90.8,51.5 86.9,51.5 85.5,50.1 LED27.2 ; LED11.2 114.1,16.5 115.5,15.1 115.5,11.2 ; LED38.2 54.5,60.4 53.1,59 41.4,59 40,57.6 LED47.2 ; 136.3,38.5 132.4,38.5 131,37.1 LED7.2 ; LED51.2 40,21.85 41.4,23.25 53.1,23.25 54.5,24.65 LED34.2 ; LED9.2 131,21.85 132.4,23.25 136.3,23.25 ; LED1.2 109.4,73.5 108,74.9 108,78.8 ; LED5.2 131,57.6 132.4,59 136.3,59 ; LED14.2 100,32.15 98.6,30.75 86.9,30.75 85.5,29.35 LED29.2 ; LED63.2 13.6,45 12.2,46.4 12.2,51.5 ; LED2.2 116.9,73.5 115.5,74.9 115.5,78.8 ; LED45.2 33.4,73.5 32,74.9 32,78.8 ; LED3.2 124.4,73.5 123,74.9 123,78.8 ; LED24.2 78.9,73.5 77.5,74.9 77.5,78.8 ; 12.2,51.5 24.5,51.5 ; 136.3,66.4 132.4,66.4 131,65 131,64 ; 108,11.2 108,15.1 106.6,16.5 LED12.2 ; LED54.2 15.6,16.5 17,15.1 17,11.2 ; 123,11.2 123,15.1 121.6,16.5 LED10.2 ; LED50.2 40,29.35 41.4,30.75 53.1,30.75 54.5,32.15 LED35.2 ; 115.5,51.4 115.5,46.4 114.1,45 LED20.2 ; LED56.2 9,32.15 7.6,30.75 3.45,30.75 ; LED17.2 100,60.4 98.6,59 86.9,59 85.5,57.6 LED26.2 ; 70,51.5 76.3,51.5 77.5,50.3 77.5,46.4 76.1,45 LED40.2 ; 70,51.5 70,46.4 68.6,45 LED41.2 ; LED53.2 23.1,16.5 24.5,15.1 24.5,11.2 ; 121.85,51.45 123,50.3 123,46.4 121.6,45 LED19.2 ; LED61.2 30.6,45 32,46.4 32,50.3 30.8,51.5 24.5,51.5 ; 108,51.5 108,46.4 106.6,45 LED21.2 ; LED25.2 85.5,65.1 86.9,66.5 98.6,66.5 100,67.9 LED18.2 ; LED15.2 100,39.9 98.6,38.5 90.8,38.5 ; 3.45,59 7.6,59 9,60.4 LED59.2 ; 24.5,51.5 24.5,46.4 23.1,45 LED62.2 ; 3.45,66.5 7.6,66.5 9,67.9 LED60.2 ; 70,11.2 70,15.1 68.6,16.5 LED32.2 ; 136.3,30.75 132.4,30.75 131,29.35 LED8.2 ; LED39.2 54.5,67.9 53.1,66.5 41.4,66.5 40,65.1 LED46.2 ; 9,25.75 9,24.75 7.6,23.35 3.45,23.35 ; 62.5,78.8 62.5,74.9 63.9,73.5 LED22.2 ; 77.5,11.2 77.5,15.1 76.1,16.5 LED31.2 ; 136.3,51.5 132.4,51.5 131,50.1 LED6.2 ; 85.5,38.5 LED28.2
  Top Layer w0.55: C4.1 65.28,22.37 66.7,20.95 75.85,20.95 76.45,21.55 76.45,26.25 75.55,27.15 U2.1
  Top Layer w1: 83,38.5 90.8,38.5 ; LED49.2 40,39.1 ; 45.35,39.08 54.5,39.08 ; 54.5,39.08 57.2,39.08 57.2,39.07 ; 54.5,39.08 LED36.2 ; 100,51.5 90.8,51.5 ; 100,51.5 121.85,51.5 ; 100,51.5 LED16.2 ; 90.8,51.5 90.8,38.5 ; 90.8,51.5 90.8,78.8 ; 90.8,38.5 90.8,11.2 ; 45.3,11.2 45.3,78.8 ; 45.3,11.2 90.8,11.2 ; 45.3,11.2 6.9,11.2 3.45,14.65 3.45,75 7.25,78.8 132.55,78.8 136.3,75.05 136.3,14.65 132.85,11.2 90.8,11.2
  Top Layer w1.5: 57.2,39.07 65.63,39.07 66.23,38.47 82.8,38.45 ; H1.3 114.28,58.95 114.28,51.75 ; H2.3 23.23,34.53 27.8,39.1 45.27,39.1
GND: length 353.9
  Top Layer w0.55: LED52.5 v1(35.9,16.5) 38.15,16.5 v1(40,18.35) ; v1(131,19.35) 131,18.45 129.05,16.5 v1(126.9,16.5) LED10.5 ; v1(40,70.4) 40,71.5 38,73.5 v1(35.9,73.5) ; v1(126.9,73.5) 129,73.5 131,71.5 v1(131,70.4) LED4.5 ; v1(85.45,47.6) 85.5,47.55 v1(85.5,42.5) ; LED13.5 100,18.2 101.75,16.45 v1(104.1,16.45) ; LED7.5 v1(131,47.65) ; 15.92,34.76 15.92,29.68 ; H2.1 18.15,37.61 15.92,39.84 ; v1(57.65,69.4) 60.95,69.4 81.2,49.15 81.2,45.35 80.85,45 LED40.5 ; v1(58.6,16.45) 56.25,16.45 54.5,18.2 LED34.5 ; v1(85.5,18.35) 83.65,16.5 v1(81.4,16.5) LED31.5 ; v1(40,42.5) 39.95,42.55 v1(39.95,47.6) ; LED25.5 v1(85.5,70.35) 85.5,71.45 83.5,73.45 v1(81.4,73.45) ; v1(103.1,69.45) 119.15,69.45 126.7,61.9 126.7,45.35 126.35,45 LED19.5 ; v1(72.03,34.4) 77.93,34.4 v2(82.04,30.29) v1(82.05,21.65) ; v1(54.5,42.4) v1(54.5,47.5) ; v1(100,42.4) v1(100,47.5) ; v1(13.1,16.45) 10.75,16.45 9,18.2 LED55.5 ; LED61.5 35.3,45 35.8,45.5 35.8,49.9 16.35,69.35 v1(12.2,69.35) ; v1(9,42.4) v1(9,47.5)
  Top Layer w1: LED19.5 v1(123.8,45) ; LED15.5 v1(100,37.7) ; LED13.5 v1(100,22.45) ; 68.32,22.4 C4.2 ; LED48.5 v1(40,52.3) ; LED41.5 v1(70.8,45) ; LED17.5 v1(100,58.2) ; LED24.5 v1(76.7,73.5) ; LED46.5 v1(40,67.3) ; LED33.5 v1(63.3,16.5) ; LED55.5 v1(9,22.45) ; LED63.5 v1(17.8,45) ; v1(54.5,37.7) LED36.5 ; LED62.5 v1(25.3,45) ; LED50.5 v1(40,31.55) ; LED1.5 v1(107.2,73.5) ; LED16.5 v1(100,47.5) ; LED3.5 v1(122.2,73.5) ; LED35.5 v1(54.5,29.95) ; LED23.5 v1(69.2,73.5) ; LED51.5 v1(40,24.05) ; LED11.5 v1(116.3,16.5) ; LED29.5 v1(85.5,31.55) ; LED44.5 v1(23.7,73.5) ; LED45.5 v1(31.2,73.5) ; LED7.5 v1(131,39.3) ; LED14.5 v1(100,29.95) ; LED43.5 v1(16.2,73.5) ; LED58.5 v1(9,47.5) ; LED5.5 v1(131,59.8) ; LED61.5 v1(32.8,45) ; LED20.5 v1(116.3,45) ; LED38.5 v1(54.5,58.2) ; LED39.5 v1(54.5,65.7) ; LED6.5 v1(131,52.3) ; LED34.5 v1(54.5,22.45) ; LED37.5 v1(54.5,47.5) ; LED56.5 v1(9,29.95) ; LED54.5 v1(17.8,16.5) ; LED9.5 v1(131,24.05) ; LED26.5 v1(85.5,59.8) ; LED53.5 v1(25.3,16.5) ; LED57.5 v1(9,37.7) ; LED40.5 v1(78.3,45) ; LED30.5 v1(85.5,24.05) ; LED8.5 v1(131,31.55) ; LED18.5 v1(100,65.7) ; LED12.5 v1(108.8,16.5) ; LED2.5 v1(114.7,73.5) ; LED52.5 v1(32.8,16.5) ; LED31.5 v1(78.3,16.5) ; LED10.5 v1(123.8,16.5) ; LED25.5 v1(85.5,67.3) ; LED60.5 v1(9,65.7) ; LED32.5 v1(70.8,16.5) ; LED49.5 v1(40,42.5) ; LED59.5 v1(9,58.2) ; LED47.5 v1(40,59.8) ; LED22.5 v1(61.7,73.5) ; LED27.5 v1(85.5,52.3) ; LED42.5 v1(63.3,45) ; LED21.5 v1(108.8,45) ; v1(85.5,42.5) LED28.5 ; LED4.5 v1(131,67.3)
  vias: v1(68.32,22.4) v1(69.37,34.4) v1(70.5,29.85) v1(72.6,29.7) v2(5.44,86.72) v2(5.44,81.64) v2(5.44,71.48) v2(5.44,61.32) v2(5.44,56.24) v2(5.44,46.08) v2(5.44,41) v2(5.44,35.92) v2(5.44,25.76) v2(5.44,20.68) v2(5.44,15.6) v2(5.44,10.52) v2(5.44,5.44) v2(10.52,81.64) v2(10.52,76.56) v2(10.52,71.48) v2(10.52,66.4) v2(10.52,30.84) v2(15.6,86.72) v2(15.6,81.64) v2(15.6,76.56) v2(15.6,66.4) v2(15.6,61.32) v2(15.6,56.24) v2(15.6,41) v2(15.6,35.92) v2(15.6,30.84) v2(15.6,25.76) v2(15.6,20.68) v2(15.6,5.44) v2(20.68,86.72) v2(20.68,81.64) v2(20.68,76.56) v2(20.68,61.32) v2(20.68,56.24) v2(20.68,41) v2(20.68,25.76) v2(20.68,20.68) v2(20.68,5.44) v2(25.76,86.72) v2(25.76,81.64) v2(25.76,76.56) v2(25.76,66.4) v2(25.76,56.24) v2(25.76,41) v2(25.76,25.76) v2(25.76,20.68) v2(25.76,5.44) v2(30.84,86.72) v2(30.84,81.64) v2(30.84,76.56) v2(30.84,71.48) v2(30.84,66.4) v2(30.84,61.32) v2(30.84,41) v2(30.84,35.92) v2(30.84,25.76) v2(30.84,20.68) v2(30.84,5.44) v2(34.25,31.17) v2(35.92,86.72) v2(35.92,81.64) v2(35.92,76.56) v2(35.92,66.4) v2(35.92,61.32) v2(35.92,56.24) v2(35.92,46.08) v2(35.92,41) v2(35.92,35.92) v2(35.92,20.68) v2(35.92,5.44) v2(41,86.72) v2(41,81.64) v2(41,76.56) v2(41,5.44) v2(46.08,86.72) v2(46.08,81.64) v2(46.08,5.44) v2(49.49,26.09) v2(51.16,86.72) v2(51.16,81.64) v2(51.16,76.56) v2(51.16,71.48) v2(51.16,61.32) v2(51.16,56.24) v2(51.16,46.08) v2(51.16,41) v2(51.16,35.92) v2(51.16,15.6) v2(51.16,5.44) v2(56.24,86.72) v2(56.24,81.64) v2(56.24,76.56) v2(56.24,71.48) v2(56.24,66.4) v2(56.24,30.84) v2(56.24,5.44) v2(59.65,26.09) v2(61.32,86.72) v2(61.32,81.64) v2(61.32,76.56) v2(61.32,66.4) v2(61.32,61.32) v2(61.32,56.24) v2(61.32,41) v2(61.32,35.92) v2(61.32,30.84) v2(61.32,5.44) v2(66.4,86.72) v2(66.4,81.64) v2(66.4,76.56) v2(66.4,61.32) v2(66.4,56.24) v2(66.4,41) v2(66.4,5.44) v2(71.48,86.72) v2(71.48,81.64) v2(71.48,76.56) v2(71.48,66.4) v2(71.48,56.24) v2(71.48,41) v2(71.48,35.92) v2(71.48,5.44) v2(74.89,26.09) v2(76.56,86.72) v2(76.56,81.64) v2(76.56,76.56) v2(76.56,71.48) v2(76.56,66.4) v2(76.56,61.32) v2(76.56,41) v2(76.56,35.92) v2(76.56,5.44) v2(81.64,86.72) v2(81.64,81.64) v2(81.64,76.56) v2(81.64,66.4) v2(81.64,61.32) v2(81.64,56.24) v2(81.64,41) v2(81.64,35.92) v2(81.64,5.44) v2(86.72,86.72) v2(86.72,81.64) v2(86.72,76.56) v2(86.72,5.44) v2(91.8,86.72) v2(91.8,81.64) v2(91.8,71.48) v2(91.8,46.08) v2(91.8,15.6) v2(91.8,5.44) v2(95.21,26.09) v2(96.88,86.72) v2(96.88,81.64) v2(96.88,76.56) v2(96.88,61.32) v2(96.88,56.24) v2(96.88,46.08) v2(96.88,41) v2(96.88,35.92) v2(96.88,15.6) v2(96.88,5.44) v2(101.96,86.72) v2(101.96,81.64) v2(101.96,76.56) v2(101.96,66.4) v2(101.96,30.84) v2(101.96,5.44) v2(105.37,26.09) v2(107.04,86.72) v2(107.04,81.64) v2(107.04,76.56) v2(107.04,71.48) v2(107.04,66.4) v2(107.04,61.32) v2(107.04,56.24) v2(107.04,41) v2(107.04,35.92) v2(107.04,30.84) v2(107.04,5.44) v2(110.45,26.09) v2(112.12,86.72) v2(112.12,81.64) v2(112.12,76.56) v2(112.12,66.4) v2(112.12,56.24) v2(112.12,41) v2(112.12,35.92) v2(112.12,30.84) v2(112.12,5.44) v2(115.53,41.33) v2(115.53,36.25) v2(115.53,31.17) v2(115.53,26.09) v2(117.2,86.72) v2(117.2,81.64) v2(117.2,76.56) v2(117.2,56.24) v2(117.2,20.68) v2(117.2,5.44) v2(122.28,86.72) v2(122.28,81.64) v2(122.28,71.48) v2(122.28,66.4) v2(122.28,61.32) v2(122.28,25.76) v2(122.28,20.68) v2(122.28,5.44) v2(127.36,81.64) v2(127.36,76.56) v2(127.36,66.4) v2(127.36,41) v2(127.36,35.92) v2(127.36,30.84) v2(127.36,25.76) v2(127.36,20.68) v2(127.36,5.44) v2(132.44,81.64) v2(132.44,76.56) v2(137.52,86.72) v2(137.52,81.64) v2(137.52,76.56) v2(137.52,71.48) v2(137.52,66.4) v2(137.52,61.32) v2(137.52,56.24) v2(137.52,51.16) v2(137.52,46.08) v2(137.52,41) v2(137.52,35.92) v2(137.52,30.84) v2(137.52,25.76) v2(137.52,20.68) v2(137.52,15.6) v2(137.52,10.52) v2(137.52,5.44)
VCC: length 130.1
  Bottom Layer w1.5: H2.6 30.85,29.07 40.02,19.9 v3(80.4,19.9) 112.5,19.9 121.85,29.25 H1.6
BI: length 27.4
  Top Layer w1: LED1.6 v1(104,71.9) 103.99,71.91 94.25,71.91
  Bottom Layer w1: H1.2 111.69,64.21 v1(104,71.9)
BO: length 19
  Top Layer w0.5: H2.2 20.69,37.46 16.6,41.55 16.6,45.6 15.6,46.6 LED63.1
BO1: length 56
  Top Layer w0.5: v2(80.35,62.95) 71.4,62.95 62.45,71.9 LED22.6 ; LED21.1 v2(103.65,46.6)
  Bottom Layer w0.5: v2(80.35,62.95) 87.3,62.95 v2(103.65,46.6)
BO2: length 56
  Top Layer w0.5: LED42.1 v2(58.15,46.6) ; LED43.6 16.95,71.9 25.9,62.95 v2(34.85,62.95)
  Bottom Layer w0.5: v2(58.15,46.6) 41.8,62.95 v2(34.85,62.95)
DI: length 26.4
  Top Layer w1: LED1.4 v1(104,75.1)
  Bottom Layer w1: v1(104,75.1) 109.85,75.1 116.77,68.18 H1.4
DO: length 29.1
  Top Layer w0.5: H2.4 25.77,28.92 24.1,27.25 15.95,27.25 14.6,28.6 LED63.3
DO1: length 65.5
  Top Layer w0.5: LED21.3 v2(103.65,43.4) ; LED22.4 v2(56.65,75.1)
  Bottom Layer w0.5: v2(103.65,43.4) 88.35,43.4 v2(56.65,75.1)
DO2: length 65.9
  Top Layer w0.5: LED43.4 v2(11.15,75.1) ; LED42.3 v2(58.15,43.4)
  Bottom Layer w0.5: v2(58.15,43.4) 42.3,43.4 11.15,74.55 v2(11.15,75.1)
EN: length 127.1
  Top Layer w0.55: v1(76.8,27.55) 76.25,28.1 U2.2
  Bottom Layer w1: H1.5 119.31,52.11 114.23,47.03 114.23,30.75 111.03,27.55 v1(76.8,27.55) 39.8,27.55 32.6,34.75 29.31,34.75 28.31,33.75 H2.5
$2N332268: length 2.7
  Top Layer w1: LED1.3 LED2.4
$2N332275: length 2.7
  Top Layer w1: LED2.3 LED3.4
$2N332294: length 2.7
  Top Layer w1: LED1.1 LED2.6
$2N332300: length 2.7
  Top Layer w1: LED2.1 LED3.6
$2N332306: length 6.1
  Top Layer w1: LED4.6 129.4,70.31 127.81,71.9 LED3.1
$2N332313: length 12.3
  Top Layer w1: LED4.4 132.6,73.2 130.7,75.1 LED3.3
$2N332321: length 2.7
  Top Layer w1: LED4.1 LED5.6
$2N332324: length 2.7
  Top Layer w1: LED4.3 LED5.4
$2N332327: length 2.7
  Top Layer w1: LED5.1 LED6.6
$2N332330: length 2.7
  Top Layer w1: LED5.3 LED6.4
$2N332493: length 2.9
  Top Layer w1: LED7.1 LED8.6
$2N332495: length 2.9
  Top Layer w1: LED7.3 LED8.4
$2N332497: length 2.7
  Top Layer w1: LED8.1 LED9.6
$2N332499: length 2.7
  Top Layer w1: LED8.3 LED9.4
$2N332503: length 6
  Top Layer w1: LED10.6 128.06,18.1 129.4,19.44 LED9.1
$2N332507: length 12
  Top Layer w1: LED10.4 130.7,14.9 132.6,16.8 LED9.3
$2N332511: length 2.7
  Top Layer w1: LED10.3 LED11.4
$2N332514: length 2.7
  Top Layer w1: LED10.1 LED11.6
$2N332517: length 2.7
  Top Layer w1: LED11.1 LED12.6
$2N332520: length 2.7
  Top Layer w1: LED11.3 LED12.4
$2N332523: length 12
  Top Layer w1: LED12.3 100.3,14.9 98.4,16.8 LED13.4
$2N332527: length 6
  Top Layer w1: LED12.1 102.94,18.1 101.6,19.44 LED13.6
$2N332531: length 2.7
  Top Layer w1: LED13.3 LED14.4
$2N332534: length 2.7
  Top Layer w1: LED13.1 LED14.6
$2N332537: length 2.9
  Top Layer w1: LED14.3 LED15.4
$2N332543: length 2.9
  Top Layer w1: LED14.1 LED15.6
$2N332549: length 8.2
  Top Layer w1: LED15.3 LED16.4
$2N332556: length 8.2
  Top Layer w1: LED16.6 LED15.1
$2N332563: length 2.7
  Top Layer w1: LED16.3 LED17.4
$2N332570: length 2.7
  Top Layer w1: LED16.1 LED17.6
$2N332577: length 2.7
  Top Layer w1: LED17.3 LED18.4
$2N332584: length 2.7
  Top Layer w1: LED17.1 LED18.6
$2N332696: length 8.2
  Top Layer w1: LED6.1 LED7.6
$2N332699: length 8.2
  Top Layer w1: LED6.3 LED7.4
$2N332702: length 41.9
  Top Layer w0.5: LED19.6 125.4,61.65 118.65,68.4 102.1,68.4 LED18.1
$2N332706: length 54.1
  Top Layer w0.5: LED19.4 126.11,43.4 127.65,44.94 127.65,62.5 119.75,70.4 99,70.4 98.4,69.8 LED18.3
$2N332712: length 2.7
  Top Layer w1: LED19.1 LED20.6
$2N332718: length 2.7
  Top Layer w1: LED19.3 LED20.4
$2N332724: length 2.7
  Top Layer w1: LED20.1 LED21.6
$2N332731: length 2.7
  Top Layer w1: LED20.3 LED21.4
$2N335047: length 2.7
  Top Layer w1: LED22.3 LED23.4
$2N335051: length 2.7
  Top Layer w1: LED23.3 LED24.4
$2N335055: length 2.7
  Top Layer w1: LED22.1 LED23.6
$2N335060: length 2.7
  Top Layer w1: LED23.1 LED24.6
$2N335064: length 6.1
  Top Layer w1: LED24.1 82.31,71.9 83.9,70.31 LED25.6
$2N335069: length 12.3
  Top Layer w1: LED25.4 87.1,73.2 85.2,75.1 LED24.3
$2N335074: length 2.7
  Top Layer w1: LED25.1 LED26.6
$2N335078: length 2.7
  Top Layer w1: LED25.3 LED26.4
$2N335082: length 2.7
  Top Layer w1: LED26.1 LED27.6
$2N335086: length 2.7
  Top Layer w1: LED27.4 LED26.3
$2N335090: length 2.9
  Top Layer w1: LED28.1 LED29.6
$2N335094: length 2.9
  Top Layer w1: LED28.3 LED29.4
$2N335098: length 2.7
  Top Layer w1: LED29.1 LED30.6
$2N335102: length 2.7
  Top Layer w1: LED29.3 LED30.4
$2N335106: length 6.2
  Top Layer w1: LED30.1 83.9,19 83,18.1 LED31.6
$2N335111: length 12
  Top Layer w1: LED31.4 85.2,14.9 87.1,16.8 LED30.3
$2N335116: length 2.7
  Top Layer w1: LED31.3 LED32.4
$2N335120: length 2.7
  Top Layer w1: LED31.1 LED32.6
$2N335124: length 2.7
  Top Layer w1: LED32.1 LED33.6
$2N335128: length 2.7
  Top Layer w1: LED32.3 LED33.4
$2N335132: length 12
  Top Layer w1: LED34.4 52.9,16.8 54.8,14.9 LED33.3
$2N335137: length 6.2
  Top Layer w1: LED34.6 56.1,19 57,18.1 LED33.1
$2N335142: length 2.7
  Top Layer w1: LED34.3 LED35.4
$2N335146: length 2.7
  Top Layer w1: LED35.6 LED34.1
$2N335150: length 2.9
  Top Layer w1: LED35.3 LED36.4
$2N335154: length 2.9
  Top Layer w1: LED35.1 LED36.6
$2N335158: length 8.2
  Top Layer w1: LED36.3 LED37.4
$2N335162: length 8.2
  Top Layer w1: LED36.1 LED37.6
$2N335166: length 2.7
  Top Layer w1: LED37.3 LED38.4
$2N335170: length 2.7
  Top Layer w1: LED37.1 LED38.6
$2N335174: length 2.7
  Top Layer w1: LED38.3 LED39.4
$2N335178: length 2.7
  Top Layer w1: LED38.1 LED39.6
$2N335182: length 8.2
  Top Layer w1: LED27.1 LED28.6
$2N335186: length 8.2
  Top Layer w1: LED27.3 LED28.4
$2N335190: length 34.5
  Top Layer w0.5: LED39.1 56.6,68.4 60.55,68.4 79.9,49.05 LED40.6
$2N335193: length 46.6
  Top Layer w0.5: LED39.3 52.9,69.8 53.5,70.4 61.35,70.4 82.15,49.6 82.15,44.94 80.61,43.4 LED40.4
$2N335200: length 2.7
  Top Layer w1: LED40.1 LED41.6
$2N335204: length 2.7
  Top Layer w1: LED40.3 LED41.4
$2N335208: length 2.7
  Top Layer w1: LED41.1 LED42.6
$2N335212: length 2.7
  Top Layer w1: LED41.3 LED42.4
$2N338899: length 2.7
  Top Layer w1: LED43.3 LED44.4
$2N338903: length 2.7
  Top Layer w1: LED44.3 LED45.4
$2N338907: length 2.7
  Top Layer w1: LED43.1 LED44.6
$2N338911: length 2.7
  Top Layer w1: LED44.1 LED45.6
$2N338915: length 6.1
  Top Layer w1: LED45.1 36.81,71.9 38.4,70.31 LED46.6
$2N338920: length 12.3
  Top Layer w1: LED45.3 39.7,75.1 41.6,73.2 LED46.4
$2N338925: length 2.7
  Top Layer w1: LED46.1 LED47.6
$2N338929: length 2.7
  Top Layer w1: LED46.3 LED47.4
$2N338933: length 2.7
  Top Layer w1: LED47.1 LED48.6
$2N338937: length 2.7
  Top Layer w1: LED47.3 LED48.4
$2N338941: length 2.9
  Top Layer w1: LED49.1 LED50.6
$2N338945: length 2.9
  Top Layer w1: LED49.3 LED50.4
$2N338949: length 2.7
  Top Layer w1: LED50.1 LED51.6
$2N338953: length 2.7
  Top Layer w1: LED50.3 LED51.4
$2N338957: length 6
  Top Layer w1: LED51.1 38.4,19.44 37.06,18.1 LED52.6
$2N338962: length 12
  Top Layer w1: LED51.3 41.6,16.8 39.7,14.9 LED52.4
$2N338967: length 2.7
  Top Layer w1: LED52.3 LED53.4
$2N338971: length 2.7
  Top Layer w1: LED52.1 LED53.6
$2N338975: length 2.7
  Top Layer w1: LED53.1 LED54.6
$2N338979: length 2.7
  Top Layer w1: LED53.3 LED54.4
$2N338983: length 12
  Top Layer w1: LED55.4 7.4,16.8 9.3,14.9 LED54.3
$2N338988: length 6
  Top Layer w1: LED54.1 11.94,18.1 10.6,19.44 LED55.6
$2N338993: length 2.7
  Top Layer w1: LED55.3 LED56.4
$2N338997: length 2.7
  Top Layer w1: LED56.6 LED55.1
$2N339001: length 2.9
  Top Layer w1: LED56.3 LED57.4
$2N339005: length 2.9
  Top Layer w1: LED57.6 LED56.1
$2N339009: length 8.2
  Top Layer w1: LED57.3 LED58.4
$2N339013: length 8.2
  Top Layer w1: LED58.6 LED57.1
$2N339017: length 2.7
  Top Layer w1: LED58.3 LED59.4
$2N339021: length 2.7
  Top Layer w1: LED58.1 LED59.6
$2N339025: length 2.7
  Top Layer w1: LED59.3 LED60.4
$2N339029: length 2.7
  Top Layer w1: LED59.1 LED60.6
$2N339033: length 8.2
  Top Layer w1: LED48.1 LED49.6
$2N339037: length 8.2
  Top Layer w1: LED48.3 LED49.4
$2N339041: length 34.9
  Top Layer w0.5: LED60.1 11.1,68.4 15.75,68.4 34.4,49.75 LED61.6
$2N339044: length 47.2
  Top Layer w0.5: LED60.3 7.4,69.8 8,70.4 16.8,70.4 36.8,50.4 36.8,45.09 35.11,43.4 LED61.4
$2N339051: length 2.7
  Top Layer w1: LED61.1 LED62.6
$2N339055: length 2.7
  Top Layer w1: LED61.3 LED62.4
$2N339059: length 2.7
  Top Layer w1: LED62.1 LED63.6
$2N339063: length 2.7
  Top Layer w1: LED62.3 LED63.4
$3N5692: length 8.6
  Top Layer w0.55: 69.33,28.1 U2.5 ; 69.33,28.1 68.7,28.1 ; 69.33,28.1 69.33,27.47 ; 69.33,27.47 68.7,28.1 ; 69.33,27.47 69.33,27.22 71.16,25.39 C2.2 ; 68.7,28.1 L1.1
$3N12733: length 3.9
  Top Layer w0.55: C2.1 74.3,24.4 U2.6

## Copper pours and planes (outline as drawn; the poured copper is in the pictures)
+5V on Top Layer: 64.39,23.25 66.15,23.25 66.15,29.7 67.2,30.65 67.2,39.22 65.76,39.83 64.4,39.83 64.4,23.26
GND on Top Layer: 68.5,34.97 68.5,30.75 70.89,28.7 72.4,28.7 72.4,27.25 72.8,26.85 73.1,26.85 73.1,34.97
GND on Bottom Layer: -4.4,91.2 144.6,91.2 144.6,-0.8 -4.4,-0.8
VCC on Top Layer: 74.2,33.45 75.95,33.45 75.95,30.65 81.15,25.7 81.15,19.15 79.65,19.15 79.65,25.95 76.85,28.77 73.35,28.77 73.35,29.42 74.2,30.65

Small or netless copper shapes (teardrops, artwork), in the pictures only: 244 on Top Layer, 10 on Bottom Layer

## Text on the board
Bottom Silkscreen Layer: GND | BO | 5V | DO | EN | VCC | BI | Set J1 to ON / for first board in series | DI | REV 2 | JES
